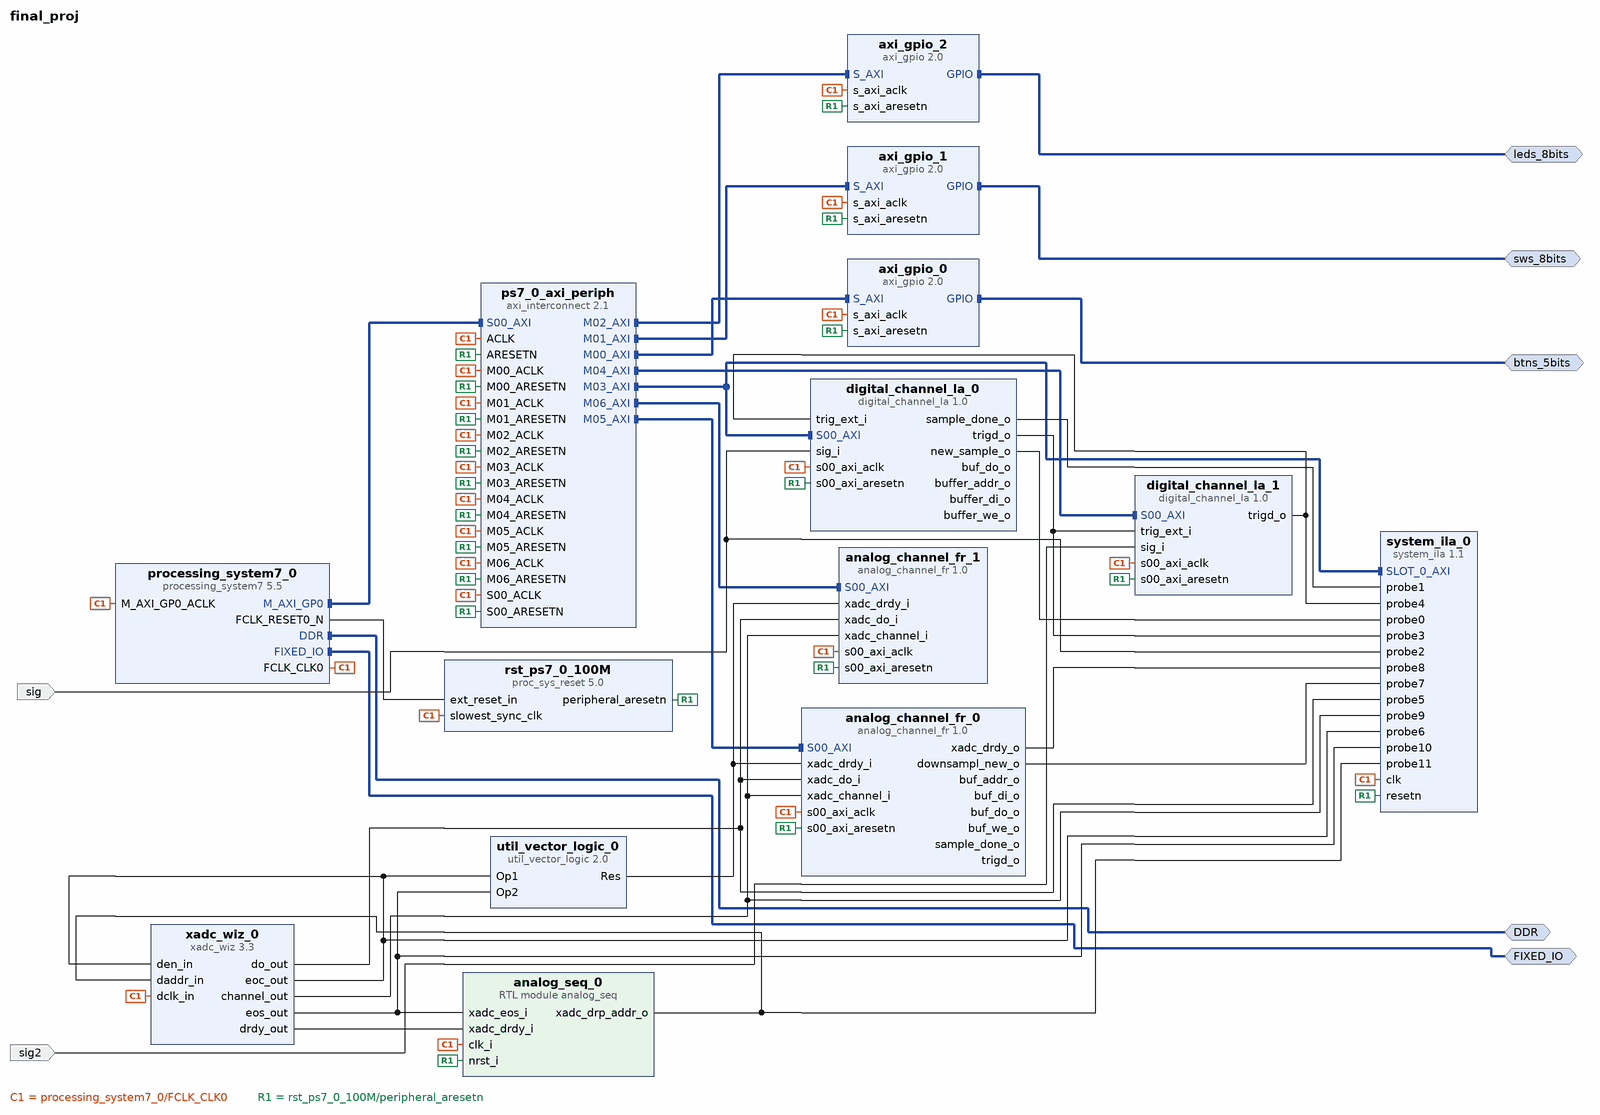
[diagram p0: block diagram of the top level]
# Vivado block design final_proj, xc7z020clg484-1, Vivado 2020.1
create_bd_design final_proj

create_bd_intf_port -mode Master -vlnv xilinx.com:interface:ddrx_rtl:1.0 DDR
create_bd_intf_port -mode Master -vlnv xilinx.com:display_processing_system7:fixedio_rtl:1.0 FIXED_IO
create_bd_intf_port -mode Master -vlnv xilinx.com:interface:gpio_rtl:1.0 btns_5bits
create_bd_intf_port -mode Master -vlnv xilinx.com:interface:gpio_rtl:1.0 sws_8bits
create_bd_intf_port -mode Master -vlnv xilinx.com:interface:gpio_rtl:1.0 leds_8bits
create_bd_port -dir I sig
create_bd_port -dir I sig2

create_bd_cell -type ip -vlnv xilinx.com:ip:processing_system7:5.5 processing_system7_0
set_property -dict [list \
  CONFIG.PCW_APU_PERIPHERAL_FREQMHZ 666.666667 \
  CONFIG.PCW_ENET0_ENET0_IO {MIO 16 .. 27} \
  CONFIG.PCW_ENET0_GRP_MDIO_ENABLE 1 \
  CONFIG.PCW_ENET0_GRP_MDIO_IO {MIO 52 .. 53} \
  CONFIG.PCW_ENET0_PERIPHERAL_ENABLE 1 \
  CONFIG.PCW_ENET0_RESET_ENABLE 0 \
  CONFIG.PCW_ENET_RESET_ENABLE 1 \
  CONFIG.PCW_ENET_RESET_SELECT {Share reset pin} \
  CONFIG.PCW_FPGA0_PERIPHERAL_FREQMHZ 100.000000 \
  CONFIG.PCW_FPGA1_PERIPHERAL_FREQMHZ 150.000000 \
  CONFIG.PCW_FPGA2_PERIPHERAL_FREQMHZ 50.000000 \
  CONFIG.PCW_GPIO_MIO_GPIO_ENABLE 1 \
  CONFIG.PCW_GPIO_MIO_GPIO_IO MIO \
  CONFIG.PCW_I2C_RESET_ENABLE 1 \
  CONFIG.PCW_PRESET_BANK1_VOLTAGE {LVCMOS 1.8V} \
  CONFIG.PCW_QSPI_GRP_SINGLE_SS_ENABLE 1 \
  CONFIG.PCW_QSPI_GRP_SINGLE_SS_IO {MIO 1 .. 6} \
  CONFIG.PCW_QSPI_PERIPHERAL_ENABLE 1 \
  CONFIG.PCW_QSPI_PERIPHERAL_FREQMHZ 200.000000 \
  CONFIG.PCW_QSPI_QSPI_IO {MIO 1 .. 6} \
  CONFIG.PCW_SD0_GRP_CD_ENABLE 1 \
  CONFIG.PCW_SD0_GRP_CD_IO {MIO 47} \
  CONFIG.PCW_SD0_GRP_WP_ENABLE 1 \
  CONFIG.PCW_SD0_GRP_WP_IO {MIO 46} \
  CONFIG.PCW_SD0_PERIPHERAL_ENABLE 1 \
  CONFIG.PCW_SD0_SD0_IO {MIO 40 .. 45} \
  CONFIG.PCW_SDIO_PERIPHERAL_FREQMHZ 50 \
  CONFIG.PCW_SINGLE_QSPI_DATA_MODE x4 \
  CONFIG.PCW_TTC0_PERIPHERAL_ENABLE 1 \
  CONFIG.PCW_TTC0_TTC0_IO EMIO \
  CONFIG.PCW_UART1_PERIPHERAL_ENABLE 1 \
  CONFIG.PCW_UART1_UART1_IO {MIO 48 .. 49} \
  CONFIG.PCW_UART_PERIPHERAL_FREQMHZ 50 \
  CONFIG.PCW_UIPARAM_DDR_FREQ_MHZ 533.333313 \
  CONFIG.PCW_UIPARAM_DDR_PARTNO {MT41J128M16 HA-15E} \
  CONFIG.PCW_USB0_PERIPHERAL_ENABLE 1 \
  CONFIG.PCW_USB0_RESET_ENABLE 0 \
  CONFIG.PCW_USB0_USB0_IO {MIO 28 .. 39} \
  CONFIG.PCW_USB_RESET_ENABLE 1 \
  CONFIG.PCW_USB_RESET_SELECT {Share reset pin} \
  CONFIG.preset ZedBoard \
] [get_bd_cells processing_system7_0]
# 221 more settings of processing_system7_0 are not shown: defaults, MIO pin electricals, DDR timing, and values the tool derives
create_bd_cell -type ip -vlnv xilinx.com:ip:axi_gpio:2.0 axi_gpio_0
set_property -dict {CONFIG.GPIO_BOARD_INTERFACE btns_5bits CONFIG.USE_BOARD_FLOW true} [get_bd_cells axi_gpio_0]
create_bd_cell -type ip -vlnv xilinx.com:ip:axi_gpio:2.0 axi_gpio_1
set_property -dict {CONFIG.GPIO_BOARD_INTERFACE sws_8bits CONFIG.USE_BOARD_FLOW true} [get_bd_cells axi_gpio_1]
create_bd_cell -type ip -vlnv xilinx.com:ip:axi_gpio:2.0 axi_gpio_2
set_property -dict {CONFIG.GPIO_BOARD_INTERFACE leds_8bits CONFIG.USE_BOARD_FLOW true} [get_bd_cells axi_gpio_2]
create_bd_cell -type ip -vlnv xilinx.com:ip:axi_interconnect:2.1 ps7_0_axi_periph
set_property -dict {CONFIG.NUM_MI 7} [get_bd_cells ps7_0_axi_periph]
create_bd_cell -type ip -vlnv xilinx.com:ip:proc_sys_reset:5.0 rst_ps7_0_100M
create_bd_cell -type ip -vlnv xilinx.com:ip:system_ila:1.1 system_ila_0
set_property -dict [list \
  CONFIG.C_MON_TYPE MIX \
  CONFIG.C_NUM_MONITOR_SLOTS 1 \
  CONFIG.C_NUM_OF_PROBES 12 \
  CONFIG.C_PROBE0_TYPE 0 \
  CONFIG.C_PROBE10_TYPE 0 \
  CONFIG.C_PROBE11_TYPE 0 \
  CONFIG.C_PROBE12_TYPE 0 \
  CONFIG.C_PROBE13_TYPE 0 \
  CONFIG.C_PROBE14_TYPE 0 \
  CONFIG.C_PROBE15_TYPE 0 \
  CONFIG.C_PROBE16_TYPE 0 \
  CONFIG.C_PROBE1_TYPE 0 \
  CONFIG.C_PROBE2_TYPE 0 \
  CONFIG.C_PROBE3_TYPE 0 \
  CONFIG.C_PROBE4_TYPE 0 \
  CONFIG.C_PROBE5_TYPE 0 \
  CONFIG.C_PROBE6_TYPE 0 \
  CONFIG.C_PROBE7_TYPE 0 \
  CONFIG.C_PROBE8_TYPE 0 \
  CONFIG.C_PROBE9_TYPE 0 \
  CONFIG.C_SLOT_0_APC_EN 0 \
  CONFIG.C_SLOT_0_AXI_AR_SEL_DATA 1 \
  CONFIG.C_SLOT_0_AXI_AR_SEL_TRIG 1 \
  CONFIG.C_SLOT_0_AXI_AW_SEL_DATA 1 \
  CONFIG.C_SLOT_0_AXI_AW_SEL_TRIG 1 \
  CONFIG.C_SLOT_0_AXI_B_SEL_DATA 1 \
  CONFIG.C_SLOT_0_AXI_B_SEL_TRIG 1 \
  CONFIG.C_SLOT_0_AXI_R_SEL_DATA 1 \
  CONFIG.C_SLOT_0_AXI_R_SEL_TRIG 1 \
  CONFIG.C_SLOT_0_AXI_W_SEL_DATA 1 \
  CONFIG.C_SLOT_0_AXI_W_SEL_TRIG 1 \
  CONFIG.C_SLOT_0_INTF_TYPE xilinx.com:interface:aximm_rtl:1.0 \
] [get_bd_cells system_ila_0]
create_bd_cell -type ip -vlnv iastate.edu:user:digital_channel_la:1.0 digital_channel_la_0
create_bd_cell -type ip -vlnv iastate.edu:user:digital_channel_la:1.0 digital_channel_la_1
create_bd_cell -type ip -vlnv xilinx.com:ip:xadc_wiz:3.3 xadc_wiz_0
set_property -dict [list \
  CONFIG.CHANNEL_ENABLE_TEMPERATURE false \
  CONFIG.CHANNEL_ENABLE_VAUXP0_VAUXN0 false \
  CONFIG.CHANNEL_ENABLE_VAUXP8_VAUXN8 true \
  CONFIG.CHANNEL_ENABLE_VP_VN true \
  CONFIG.ENABLE_RESET true \
  CONFIG.ENABLE_VCCDDRO_ALARM false \
  CONFIG.ENABLE_VCCPAUX_ALARM false \
  CONFIG.ENABLE_VCCPINT_ALARM false \
  CONFIG.EXTERNAL_MUX_CHANNEL VP_VN \
  CONFIG.INTERFACE_SELECTION ENABLE_DRP \
  CONFIG.OT_ALARM false \
  CONFIG.SEQUENCER_MODE Continuous \
  CONFIG.SINGLE_CHANNEL_SELECTION VP_VN \
  CONFIG.USER_TEMP_ALARM false \
  CONFIG.VCCAUX_ALARM false \
  CONFIG.VCCINT_ALARM false \
  CONFIG.XADC_STARUP_SELECTION channel_sequencer \
] [get_bd_cells xadc_wiz_0]
create_bd_cell -type ip -vlnv iastate.edu:user:analog_channel_fr:1.0 analog_channel_fr_0
create_bd_cell -type module -reference analog_seq analog_seq_0
create_bd_cell -type ip -vlnv iastate.edu:user:analog_channel_fr:1.0 analog_channel_fr_1
create_bd_cell -type ip -vlnv xilinx.com:ip:util_vector_logic:2.0 util_vector_logic_0
set_property -dict {CONFIG.C_OPERATION or CONFIG.C_SIZE 1} [get_bd_cells util_vector_logic_0]

# ---- connections ----

connect_bd_intf_net [get_bd_intf_pins ps7_0_axi_periph/M02_AXI] [get_bd_intf_pins axi_gpio_2/S_AXI]
connect_bd_intf_net [get_bd_intf_pins ps7_0_axi_periph/M05_AXI] [get_bd_intf_pins analog_channel_fr_0/S00_AXI]
connect_bd_intf_net [get_bd_intf_pins ps7_0_axi_periph/M01_AXI] [get_bd_intf_pins axi_gpio_1/S_AXI]
connect_bd_intf_net [get_bd_intf_ports DDR] [get_bd_intf_pins processing_system7_0/DDR]
connect_bd_intf_net [get_bd_intf_ports leds_8bits] [get_bd_intf_pins axi_gpio_2/GPIO]
connect_bd_intf_net [get_bd_intf_ports FIXED_IO] [get_bd_intf_pins processing_system7_0/FIXED_IO]
connect_bd_intf_net [get_bd_intf_ports sws_8bits] [get_bd_intf_pins axi_gpio_1/GPIO]
connect_bd_intf_net [get_bd_intf_pins ps7_0_axi_periph/M00_AXI] [get_bd_intf_pins axi_gpio_0/S_AXI]
connect_bd_intf_net -intf_net ps7_0_axi_periph_M03_AXI [get_bd_intf_pins ps7_0_axi_periph/M03_AXI] [get_bd_intf_pins digital_channel_la_0/S00_AXI]
connect_bd_intf_net [get_bd_intf_pins ps7_0_axi_periph/M03_AXI] [get_bd_intf_pins system_ila_0/SLOT_0_AXI]
connect_bd_intf_net [get_bd_intf_pins ps7_0_axi_periph/M04_AXI] [get_bd_intf_pins digital_channel_la_1/S00_AXI]
connect_bd_intf_net [get_bd_intf_pins processing_system7_0/M_AXI_GP0] [get_bd_intf_pins ps7_0_axi_periph/S00_AXI]
connect_bd_intf_net [get_bd_intf_ports btns_5bits] [get_bd_intf_pins axi_gpio_0/GPIO]
connect_bd_intf_net [get_bd_intf_pins ps7_0_axi_periph/M06_AXI] [get_bd_intf_pins analog_channel_fr_1/S00_AXI]
connect_bd_net [get_bd_pins processing_system7_0/FCLK_CLK0] \
  [get_bd_pins processing_system7_0/M_AXI_GP0_ACLK] [get_bd_pins ps7_0_axi_periph/S00_ACLK] \
  [get_bd_pins rst_ps7_0_100M/slowest_sync_clk] [get_bd_pins axi_gpio_0/s_axi_aclk] [get_bd_pins ps7_0_axi_periph/M00_ACLK] \
  [get_bd_pins ps7_0_axi_periph/ACLK] [get_bd_pins axi_gpio_1/s_axi_aclk] [get_bd_pins ps7_0_axi_periph/M01_ACLK] \
  [get_bd_pins axi_gpio_2/s_axi_aclk] [get_bd_pins ps7_0_axi_periph/M02_ACLK] [get_bd_pins ps7_0_axi_periph/M03_ACLK] \
  [get_bd_pins system_ila_0/clk] [get_bd_pins ps7_0_axi_periph/M04_ACLK] [get_bd_pins digital_channel_la_0/s00_axi_aclk] \
  [get_bd_pins digital_channel_la_1/s00_axi_aclk] [get_bd_pins ps7_0_axi_periph/M05_ACLK] [get_bd_pins xadc_wiz_0/dclk_in] \
  [get_bd_pins ps7_0_axi_periph/M06_ACLK] [get_bd_pins analog_channel_fr_0/s00_axi_aclk] [get_bd_pins analog_seq_0/clk_i] \
  [get_bd_pins analog_channel_fr_1/s00_axi_aclk]
connect_bd_net [get_bd_pins processing_system7_0/FCLK_RESET0_N] [get_bd_pins rst_ps7_0_100M/ext_reset_in]
connect_bd_net [get_bd_pins rst_ps7_0_100M/peripheral_aresetn] \
  [get_bd_pins ps7_0_axi_periph/S00_ARESETN] [get_bd_pins axi_gpio_0/s_axi_aresetn] \
  [get_bd_pins ps7_0_axi_periph/M00_ARESETN] [get_bd_pins ps7_0_axi_periph/ARESETN] [get_bd_pins axi_gpio_1/s_axi_aresetn] \
  [get_bd_pins ps7_0_axi_periph/M01_ARESETN] [get_bd_pins axi_gpio_2/s_axi_aresetn] \
  [get_bd_pins ps7_0_axi_periph/M02_ARESETN] [get_bd_pins ps7_0_axi_periph/M03_ARESETN] [get_bd_pins system_ila_0/resetn] \
  [get_bd_pins ps7_0_axi_periph/M04_ARESETN] [get_bd_pins digital_channel_la_0/s00_axi_aresetn] \
  [get_bd_pins digital_channel_la_1/s00_axi_aresetn] [get_bd_pins ps7_0_axi_periph/M05_ARESETN] \
  [get_bd_pins ps7_0_axi_periph/M06_ARESETN] [get_bd_pins analog_channel_fr_0/s00_axi_aresetn] \
  [get_bd_pins analog_seq_0/nrst_i] [get_bd_pins analog_channel_fr_1/s00_axi_aresetn]
connect_bd_net -net sig_1 [get_bd_ports sig] [get_bd_pins digital_channel_la_0/sig_i] [get_bd_pins system_ila_0/probe2]
# net sig_valid_o has one end: 
connect_bd_net -net trigd_o [get_bd_pins digital_channel_la_0/trigd_o] [get_bd_pins digital_channel_la_1/trig_ext_i] [get_bd_pins system_ila_0/probe3]
connect_bd_net -net sample_done_o [get_bd_pins digital_channel_la_0/sample_done_o] [get_bd_pins system_ila_0/probe1]
# net buf_do_o has one end: digital_channel_la_0/buf_do_o
# net buffer_we_o has one end: digital_channel_la_0/buffer_we_o
# net buffer_addr_o has one end: digital_channel_la_0/buffer_addr_o
# net buffer_di_o has one end: digital_channel_la_0/buffer_di_o
connect_bd_net -net new_sample_o [get_bd_pins digital_channel_la_0/new_sample_o] [get_bd_pins system_ila_0/probe0]
connect_bd_net -net digital_channel_la_1_trigd_o [get_bd_pins digital_channel_la_1/trigd_o] \
  [get_bd_pins digital_channel_la_0/trig_ext_i] [get_bd_pins system_ila_0/probe4]
connect_bd_net -net sig2_1 [get_bd_ports sig2] [get_bd_pins digital_channel_la_1/sig_i]
connect_bd_net -net xadc_wiz_0_eoc_out [get_bd_pins xadc_wiz_0/eoc_out] \
  [get_bd_pins xadc_wiz_0/den_in] [get_bd_pins system_ila_0/probe6] [get_bd_pins util_vector_logic_0/Op1]
connect_bd_net -net xadc_wiz_0_do_out [get_bd_pins xadc_wiz_0/do_out] \
  [get_bd_pins analog_channel_fr_0/xadc_do_i] [get_bd_pins system_ila_0/probe5] [get_bd_pins analog_channel_fr_1/xadc_do_i]
# net buf_do_o_1 has one end: analog_channel_fr_0/buf_do_o
# net buf_di_o has one end: analog_channel_fr_0/buf_di_o
# net buf_addr_o has one end: analog_channel_fr_0/buf_addr_o
# net buf_we_o has one end: analog_channel_fr_0/buf_we_o
# net sample_done_o_1 has one end: analog_channel_fr_0/sample_done_o
# net trigd_o_1 has one end: analog_channel_fr_0/trigd_o
connect_bd_net -net xadc_drdy_o [get_bd_pins analog_channel_fr_0/xadc_drdy_o] [get_bd_pins system_ila_0/probe8]
connect_bd_net -net downsampl_new_o [get_bd_pins analog_channel_fr_0/downsampl_new_o] [get_bd_pins system_ila_0/probe7]
connect_bd_net -net xadc_wiz_0_channel_out [get_bd_pins xadc_wiz_0/channel_out] \
  [get_bd_pins analog_channel_fr_0/xadc_channel_i] [get_bd_pins system_ila_0/probe9] \
  [get_bd_pins analog_channel_fr_1/xadc_channel_i]
connect_bd_net -net eos_out [get_bd_pins xadc_wiz_0/eos_out] \
  [get_bd_pins system_ila_0/probe10] [get_bd_pins analog_seq_0/xadc_eos_i] [get_bd_pins util_vector_logic_0/Op2]
connect_bd_net -net analog_seq_0_xadc_drp_addr_o [get_bd_pins analog_seq_0/xadc_drp_addr_o] \
  [get_bd_pins xadc_wiz_0/daddr_in] [get_bd_pins system_ila_0/probe11]
connect_bd_net -net analog_seq_0_drdy_a_o [get_bd_pins xadc_wiz_0/drdy_out] [get_bd_pins analog_seq_0/xadc_drdy_i]
connect_bd_net [get_bd_pins util_vector_logic_0/Res] [get_bd_pins analog_channel_fr_1/xadc_drdy_i] [get_bd_pins analog_channel_fr_0/xadc_drdy_i]
set_property HDL_ATTRIBUTE.DEBUG true [get_bd_intf_nets ps7_0_axi_periph_M03_AXI]
set_property HDL_ATTRIBUTE.MARK_DEBUG true [get_bd_intf_nets ps7_0_axi_periph_M03_AXI]
set_property HDL_ATTRIBUTE.DEBUG true [get_bd_nets sig_1]
set_property HDL_ATTRIBUTE.MARK_DEBUG true [get_bd_nets sig_1]
set_property HDL_ATTRIBUTE.DEBUG true [get_bd_nets sig_valid_o]
set_property HDL_ATTRIBUTE.MARK_DEBUG true [get_bd_nets sig_valid_o]
set_property HDL_ATTRIBUTE.DEBUG true [get_bd_nets trigd_o]
set_property HDL_ATTRIBUTE.MARK_DEBUG true [get_bd_nets trigd_o]
set_property HDL_ATTRIBUTE.DEBUG true [get_bd_nets sample_done_o]
set_property HDL_ATTRIBUTE.MARK_DEBUG true [get_bd_nets sample_done_o]
set_property HDL_ATTRIBUTE.DEBUG true [get_bd_nets new_sample_o]
set_property HDL_ATTRIBUTE.MARK_DEBUG true [get_bd_nets new_sample_o]
set_property HDL_ATTRIBUTE.DEBUG true [get_bd_nets digital_channel_la_1_trigd_o]
set_property HDL_ATTRIBUTE.MARK_DEBUG true [get_bd_nets digital_channel_la_1_trigd_o]
set_property HDL_ATTRIBUTE.DEBUG true [get_bd_nets xadc_wiz_0_eoc_out]
set_property HDL_ATTRIBUTE.MARK_DEBUG true [get_bd_nets xadc_wiz_0_eoc_out]
set_property HDL_ATTRIBUTE.DEBUG true [get_bd_nets xadc_wiz_0_do_out]
set_property HDL_ATTRIBUTE.MARK_DEBUG true [get_bd_nets xadc_wiz_0_do_out]
set_property HDL_ATTRIBUTE.DEBUG true [get_bd_nets xadc_drdy_o]
set_property HDL_ATTRIBUTE.MARK_DEBUG true [get_bd_nets xadc_drdy_o]
set_property HDL_ATTRIBUTE.DEBUG true [get_bd_nets downsampl_new_o]
set_property HDL_ATTRIBUTE.MARK_DEBUG true [get_bd_nets downsampl_new_o]
set_property HDL_ATTRIBUTE.DEBUG true [get_bd_nets xadc_wiz_0_channel_out]
set_property HDL_ATTRIBUTE.MARK_DEBUG true [get_bd_nets xadc_wiz_0_channel_out]
set_property HDL_ATTRIBUTE.DEBUG true [get_bd_nets eos_out]
set_property HDL_ATTRIBUTE.MARK_DEBUG true [get_bd_nets eos_out]
set_property HDL_ATTRIBUTE.DEBUG true [get_bd_nets analog_seq_0_xadc_drp_addr_o]
set_property HDL_ATTRIBUTE.MARK_DEBUG true [get_bd_nets analog_seq_0_xadc_drp_addr_o]

# ---- address map ----
assign_bd_address -offset 0x41200000 -range 64K -target_address_space [get_bd_addr_spaces processing_system7_0/Data] [get_bd_addr_segs axi_gpio_0/S_AXI/Reg]
assign_bd_address -offset 0x41210000 -range 64K -target_address_space [get_bd_addr_spaces processing_system7_0/Data] [get_bd_addr_segs axi_gpio_1/S_AXI/Reg]
assign_bd_address -offset 0x41220000 -range 64K -target_address_space [get_bd_addr_spaces processing_system7_0/Data] [get_bd_addr_segs axi_gpio_2/S_AXI/Reg]
assign_bd_address -offset 0x43C00000 -range 64K -target_address_space [get_bd_addr_spaces processing_system7_0/Data] [get_bd_addr_segs digital_channel_la_0/S00_AXI/S00_AXI_reg]
assign_bd_address -offset 0x43C10000 -range 64K -target_address_space [get_bd_addr_spaces processing_system7_0/Data] [get_bd_addr_segs digital_channel_la_1/S00_AXI/S00_AXI_reg]
assign_bd_address -offset 0x43C20000 -range 64K -target_address_space [get_bd_addr_spaces processing_system7_0/Data] [get_bd_addr_segs analog_channel_fr_0/S00_AXI/S00_AXI_reg]
assign_bd_address -offset 0x43C30000 -range 64K -target_address_space [get_bd_addr_spaces processing_system7_0/Data] [get_bd_addr_segs analog_channel_fr_1/S00_AXI/S00_AXI_reg]

validate_bd_design
save_bd_design
